# Altium schematic sheet ADCHighVoltageInputsSchDoc.SchDoc: High Voltage Inputs
size 292 x 193 mm; CheckedBy: Łukasz Gójski; Author: Jakub Howors; CompanyName: Politechnika Warszawska; Organization: EITI; Address1: Nowowiejska 15/19; Address2: 00-665 Warszawa; SheetNumber: 9; SheetTotal: 13; HTTPLink: www.pw.edu.pl
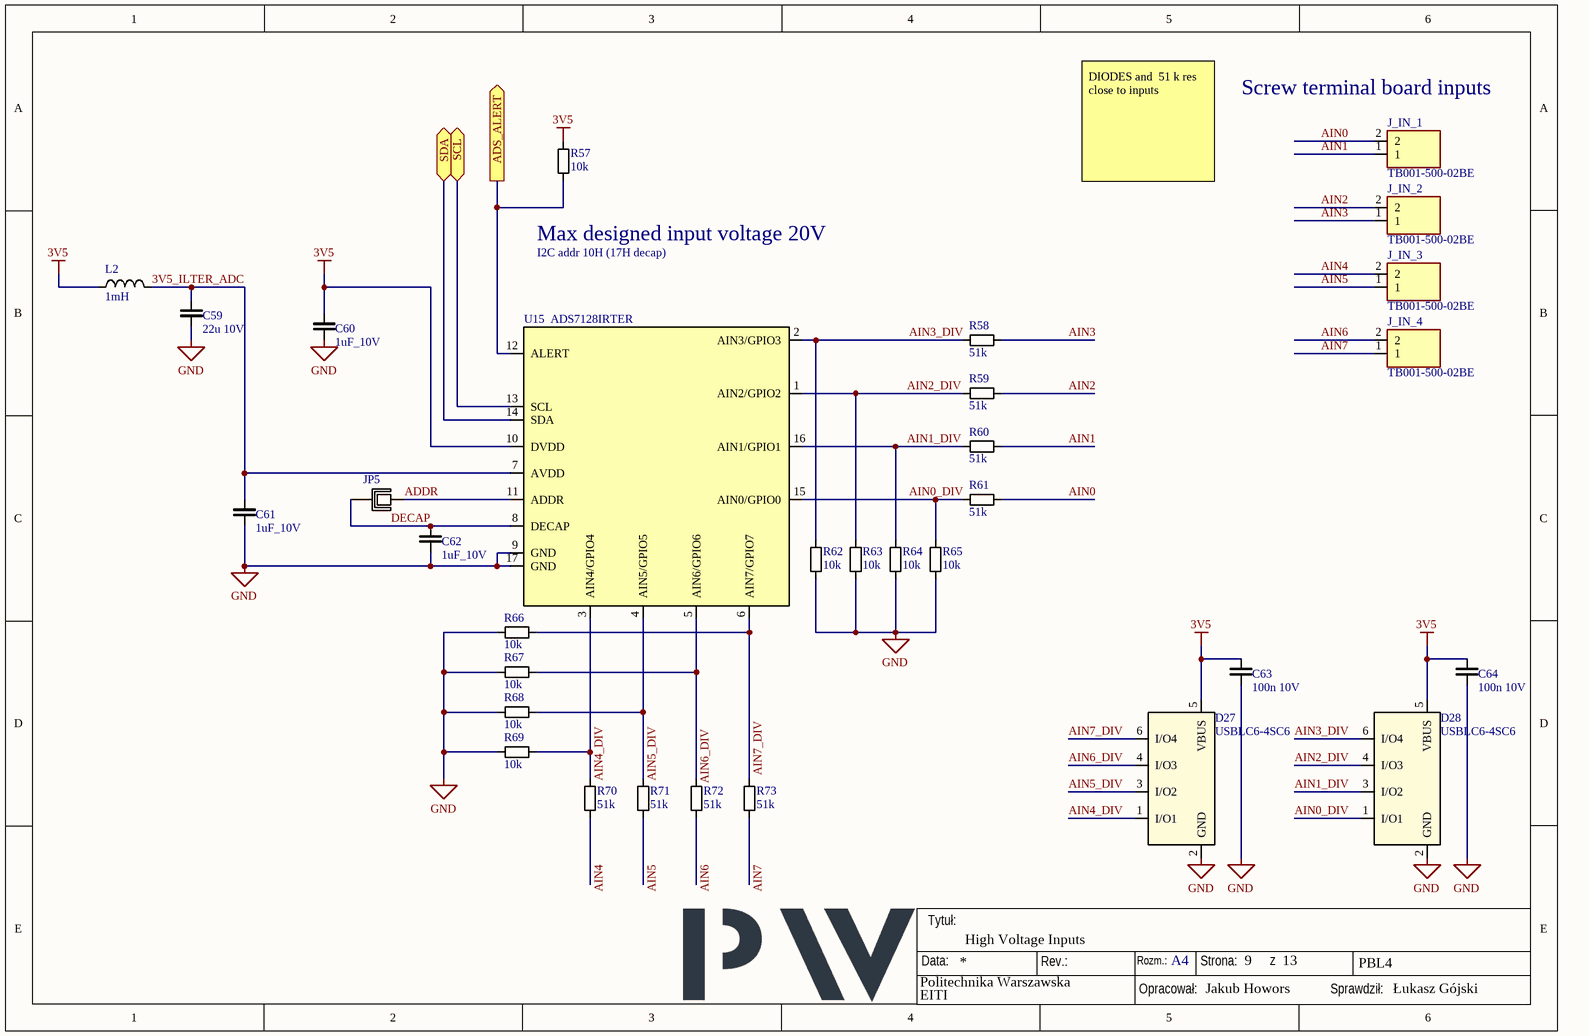
[diagram p0: ADCHighVoltageInputsSchDoc.SchDoc]

## Parts
C59  22u 10V  [C_1206]
C60  1uF_10V  [C_0603]
C61  1uF_10V  [C_0603]
C62  1uF_10V  [C_0603]
C63  100n 10V  [C_0603]
C64  100n 10V  [C_0603]
D27  USBLC6-4SC6  [SOT23-6L_STM]
D28  USBLC6-4SC6  [SOT23-6L_STM]
J_IN_1  TB001-500-02BE  [TB00150002BE]
J_IN_2  TB001-500-02BE  [TB00150002BE]
J_IN_3  TB001-500-02BE  [TB00150002BE]
J_IN_4  TB001-500-02BE  [TB00150002BE]
JP5  JUMPER  [Jumper]  (value not drawn)
L2  1mH  [L_1007]
R57  10k  [R_0603]
R58  51k  [R_0603]
R59  51k  [R_0603]
R60  51k  [R_0603]
R61  51k  [R_0603]
R62  10k  [R_0603]
R63  10k  [R_0603]
R64  10k  [R_0603]
R65  10k  [R_0603]
R66  10k  [R_0603]
R67  10k  [R_0603]
R68  10k  [R_0603]
R69  10k  [R_0603]
R70  51k  [R_0603]
R71  51k  [R_0603]
R72  51k  [R_0603]
R73  51k  [R_0603]
U15  ADS7128IRTER  [ADS7128_RTE0016C]

## Ports
ADS_ALERT (out, see MainAssembly[2B]), SCL (bidir, see MainAssembly[1B], DAC[3C], DCDCreg[2C], GPIOExpander[2B], PWMExpander[2B], USBPD[4C]), SDA (bidir, see MainAssembly[1B], DAC[3C], DCDCreg[2C], GPIOExpander[2B], PWMExpander[2A], USBPD[4C])

## Nets
3V5: C60.2 C63.2 C64.2 D27.5(VBUS) D28.5(VBUS) L2.1 R57.2 U15.10(DVDD)
GND: C59.1 C60.1 C61.1 C62.1 C63.1 C64.1 D27.2(GND) D28.2(GND) R62.2 R63.2 R64.2 R65.2 R66.2 R67.2 R68.2 R69.2 U15.9(GND) U15.17(GND)
3V5_ILTER_ADC: C59.2 C61.2 L2.2 U15.7(AVDD)
ADDR: JP5.1 U15.11(ADDR)
ADS_ALERT: R57.1 U15.12(ALERT) ; port ADS_ALERT
AIN0: J_IN_1.2 R61.2
AIN0_DIV: D28.1(I/O1) R61.1 R65.1 U15.15(AIN0/GPIO0)
AIN1: J_IN_1.1 R60.2
AIN1_DIV: D28.3(I/O2) R60.1 R64.1 U15.16(AIN1/GPIO1)
AIN2: J_IN_2.2 R59.2
AIN2_DIV: D28.4(I/O3) R59.1 R63.1 U15.1(AIN2/GPIO2)
AIN3: J_IN_2.1 R58.2
AIN3_DIV: D28.6(I/O4) R58.1 R62.1 U15.2(AIN3/GPIO3)
AIN4: J_IN_3.2 R70.2
AIN4_DIV: D27.1(I/O1) R69.1 R70.1 U15.3(AIN4/GPIO4)
AIN5: J_IN_3.1 R71.2
AIN5_DIV: D27.3(I/O2) R68.1 R71.1 U15.4(AIN5/GPIO5)
AIN6: J_IN_4.2 R72.2
AIN6_DIV: D27.4(I/O3) R67.1 R72.1 U15.5(AIN6/GPIO6)
AIN7: J_IN_4.1 R73.2
AIN7_DIV: D27.6(I/O4) R66.1 R73.1 U15.6(AIN7/GPIO7)
DECAP: C62.2 JP5.2 U15.8(DECAP)
SCL: U15.13(SCL) ; port SCL
SDA: U15.14(SDA) ; port SDA

## Notes on the sheet
- (near J_IN_1) Screw terminal board inputs
- DIODES and  51 k res close to inputs
- (near R57) Max designed input voltage 20V
- I2C addr 10H (17H decap)
- Data:
- Tytuł:
- Rev.:
- Rozm.:
- A4
- Strona:
- z
- PBL4
- Opracował:
- Sprawdził:

## Library data of the parts
C59 = C_22uF_10V: Ceramic capacitor; Casing: 1206; Dielectric: X5R; Tolerance: 20%; Value: 22u; Voltage: 10V; Technology: Ceramic
C60-C62 = C_1uF_10V: Ceramic capacitor; Value: 1u; Voltage: 10V; Casing: 0603; Dielectric: X7R; Tolerance: 10%; Technology: Ceramic
C63 C64 = C_100nF_10V: Ceramic capacitor; Casing: 0603; Dielectric: X7R; Tolerance: 10%; Value: 100n; Voltage: 10V; Technology: Ceramic
D27 D28 = USBLC6-4SC6: Very low capacitance ESD protection; Manufacturer: STMicroelectronics; Manufacturer_Part_Number: USBLC6-4SC6
J_IN_1-J_IN_4 = Screw Terminal x2 5mm: Screw terminal x2 5mm spacing; Manufacturer: Same Sky; MP: TB001-500-02BE
JP5 = Jumper x2: Jumper on traces
L2 = L_1mH: Inductor; Casing: 1007; Tolerance: 20%; Idc: 15mA; Value: 1mH
R57 = R_10k: Resistor; Tolerance: 1%; Power: 100mW; Casing: 0603; Value: 10k
R58-R61 R70-R73 = R_51k_LT: Tolerance: 0.1%; Power: 100mW; Casing: 0603; Value: 51k
R62-R69 = R_10k_LT: Tolerance: 0.1%; Power: 125mW; Casing: 0603; Value: 10k
U15 = IC_ads7128_ADS7128IRTER: Small 8-ch 12-bit analog-to-digital converter (ADC) with I2C interface, GPIOs, CRC and RMS module 16-WQFN -40 to 85; Manufacturer_Name: Texas Instruments; Type: Data Acquisition; Copyright: Copyright (C) 2026 Ultra Librarian. All rights reserved.; Manufacturer_Part_Number: ADS7128IRTER; Datasheet: https://www.ti.com/lit/gpn/ads7128; RefDes: RefDes